# Altium schematic sheet SPEC_A7_Managment-TOP.SchDoc
size 420 x 297 mm; DrawnBy: A.B.; Organization: Wydział Elektroniki i Technik Informacyjnych; Address1: ul. Nowowiejska 15/19; Address2: 00-665 Warszawa; Address3: NSW; Address4: Polska; Revision: 0; SheetNumber: 1; SheetTotal: 5; CreateDate: 20/06/2024; Designer: A.B.; Projet: Spec7; CheckedDate: -; ModifiedBy: -
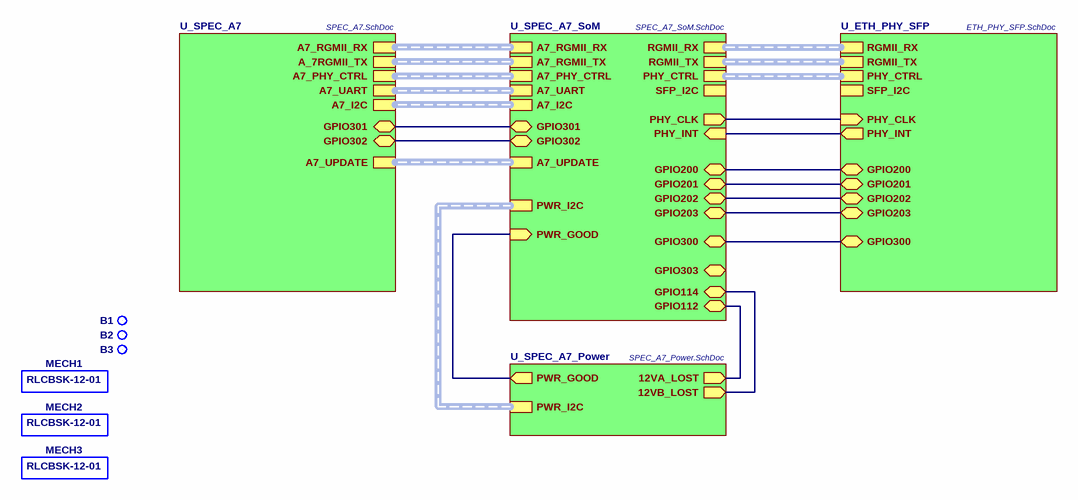
[diagram p0: SPEC_A7_Managment-TOP.SchDoc]

## Parts
B1  Non Plated Hole  [MTG400]  (value not drawn)  (no BOM)
B2  Non Plated Hole  [MTG400]  (value not drawn)  (no BOM)
B3  Non Plated Hole  [MTG400]  (value not drawn)  (no BOM)
MECH1  RLCBSK-12-01  [GENERIC_MECH]
MECH2  RLCBSK-12-01  [GENERIC_MECH]
MECH3  RLCBSK-12-01  [GENERIC_MECH]

## Sub-sheets
U_ETH_PHY_SFP = ETH_PHY_SFP.SchDoc: RGMII_RX (harness RGMII), RGMII_TX (harness RGMII), PHY_CTRL (harness PHY_CTRL), PHY_CLK (in), SFP_I2C (harness I2C), PHY_INT (out), GPIO200 (bidir), GPIO203 (bidir), GPIO201 (bidir), GPIO300 (bidir), GPIO202 (bidir)
U_SPEC_A7 = SPEC_A7.SchDoc: A7_RGMII_RX (harness RGMII), A_7RGMII_TX (harness RGMII), A7_PHY_CTRL (harness PHY_CTRL), A7_I2C (harness I2C), A7_UART (harness UART), GPIO302 (bidir), GPIO301 (bidir), A7_UPDATE (harness FPGA_UPDATE)
U_SPEC_A7_Power = SPEC_A7_Power.SchDoc: PWR_I2C (harness I2C), PWR_GOOD (out), 12VA_LOST (out), 12VB_LOST (out)
U_SPEC_A7_SoM = SPEC_A7_SoM.SchDoc: RGMII_RX (harness RGMII), RGMII_TX (harness RGMII), PHY_CTRL (harness PHY_CTRL), A7_RGMII_RX (harness RGMII), A7_RGMII_TX (harness RGMII), A7_PHY_CTRL (harness PHY_CTRL), PHY_CLK (out), PHY_INT (in), SFP_I2C (harness I2C), PWR_I2C (harness I2C), A7_I2C (harness I2C), A7_UART (harness UART), PWR_GOOD (in), GPIO302 (bidir), GPIO200 (bidir), GPIO303 (bidir), GPIO203 (bidir), GPIO202 (bidir), GPIO201 (bidir), GPIO301 (bidir), GPIO300 (bidir), A7_UPDATE (harness FPGA_UPDATE), GPIO114 (bidir), GPIO112 (bidir)

## Nets
(unnamed): sheet U_ETH_PHY_SFP/PHY_CLK, sheet U_SPEC_A7_SoM/PHY_CLK
(unnamed): sheet U_ETH_PHY_SFP/PHY_INT, sheet U_SPEC_A7_SoM/PHY_INT
(unnamed): sheet U_ETH_PHY_SFP/GPIO200, sheet U_SPEC_A7_SoM/GPIO200
(unnamed): sheet U_ETH_PHY_SFP/GPIO203, sheet U_SPEC_A7_SoM/GPIO203
(unnamed): sheet U_ETH_PHY_SFP/GPIO201, sheet U_SPEC_A7_SoM/GPIO201
(unnamed): sheet U_ETH_PHY_SFP/GPIO300, sheet U_SPEC_A7_SoM/GPIO300
(unnamed): sheet U_ETH_PHY_SFP/GPIO202, sheet U_SPEC_A7_SoM/GPIO202
(unnamed): sheet U_SPEC_A7/GPIO302, sheet U_SPEC_A7_SoM/GPIO302
(unnamed): sheet U_SPEC_A7/GPIO301, sheet U_SPEC_A7_SoM/GPIO301
(unnamed): sheet U_SPEC_A7_Power/PWR_GOOD, sheet U_SPEC_A7_SoM/PWR_GOOD
(unnamed): sheet U_SPEC_A7_Power/12VA_LOST, sheet U_SPEC_A7_SoM/GPIO112
(unnamed): sheet U_SPEC_A7_Power/12VB_LOST, sheet U_SPEC_A7_SoM/GPIO114

Not connected (* = marked no-connect by the designer): B1 1; B2 1; B3 1

## Buses and harness runs
harness sheet U_ETH_PHY_SFP/PHY_CTRL = sheet U_SPEC_A7_SoM/PHY_CTRL
harness sheet U_ETH_PHY_SFP/RGMII_RX = sheet U_SPEC_A7_SoM/RGMII_RX
harness sheet U_ETH_PHY_SFP/RGMII_TX = sheet U_SPEC_A7_SoM/RGMII_TX
harness sheet U_SPEC_A7/A7_I2C = sheet U_SPEC_A7_SoM/A7_I2C
harness sheet U_SPEC_A7/A7_PHY_CTRL = sheet U_SPEC_A7_SoM/A7_PHY_CTRL
harness sheet U_SPEC_A7/A7_RGMII_RX = sheet U_SPEC_A7_SoM/A7_RGMII_RX
harness sheet U_SPEC_A7/A7_UART = sheet U_SPEC_A7_SoM/A7_UART
harness sheet U_SPEC_A7/A7_UPDATE = sheet U_SPEC_A7_SoM/A7_UPDATE
harness sheet U_SPEC_A7/A_7RGMII_TX = sheet U_SPEC_A7_SoM/A7_RGMII_TX
harness sheet U_SPEC_A7_Power/PWR_I2C = sheet U_SPEC_A7_SoM/PWR_I2C

## Notes on the sheet
- Project/Equipment
- Document
- Designer
- Drawn by
- Check.by
- Copyright WUT ISE 2024.
  This documentation describes Open Hardware and is licensed under the CERN OHL v.2. You may redistribute and modify this documentation under the terms of the CERN OHL v.2. (http://ohwr.org/CERNOHL). This documentation is distributed WITHOUT ANY EXPRESS OR IMPLIED WARRANTY, INCLUDING OF MERCHANTABILITY, SATISFACTORY QUALITY AND FITNESS FOR A PARTICULAR PURPOSE. Please see the CERN OHL v.2 for applicable conditions.
- Contact
- File
- Last Mod.
- Print Date
- Sheet
- Size
- A3
- of
- Rev

## Library data of the parts
B1-B3 = NON-PLATED_HOLE4.0: Single Terminal Socket; Part Description: Non Plated Through Hole: Hole Dia.=4.0mm; Mounted: No; Part Number: NON-PLATED_HOLE4.0; Component Type: Standard (No BOM); Pin Count: 1; Family: Non Plated Hole; Socket: No; SMD: No; Sense: No; Status: None; ComponentHeight: 0mm; HelpURL: Undefined; Author: CERN DEM JMW; CreateDate: 22.03.2019; LatestRevisionDate: 22.03.2019; PackageDescription: Non Plated Through Hole: Hole Dia.=4.0mm
MECH1-MECH3 = Generic_mechanical: generic; Part Number: Essentra; Part Description: 12mm nylon standoff; PressFit: No; Component Kind: Accessories; Component Type: Standard; Footprint: generic_MECH; Pin Count: 0; PackageDescription: generic; Mounted: Yes; Socket: No; SMD: No; Sense: No; Status: None; Value: RLCBSK-12-01; Manufacturer: Essentra; Manufacturer Part Number: RLCBSK-12-01; ComponentHeight: 12; Author: GK; CreateDate: 28.10.2019; LatestRevisionDate: 28.10.2019